# EAGLE design board (EAGLE 9.3.0)
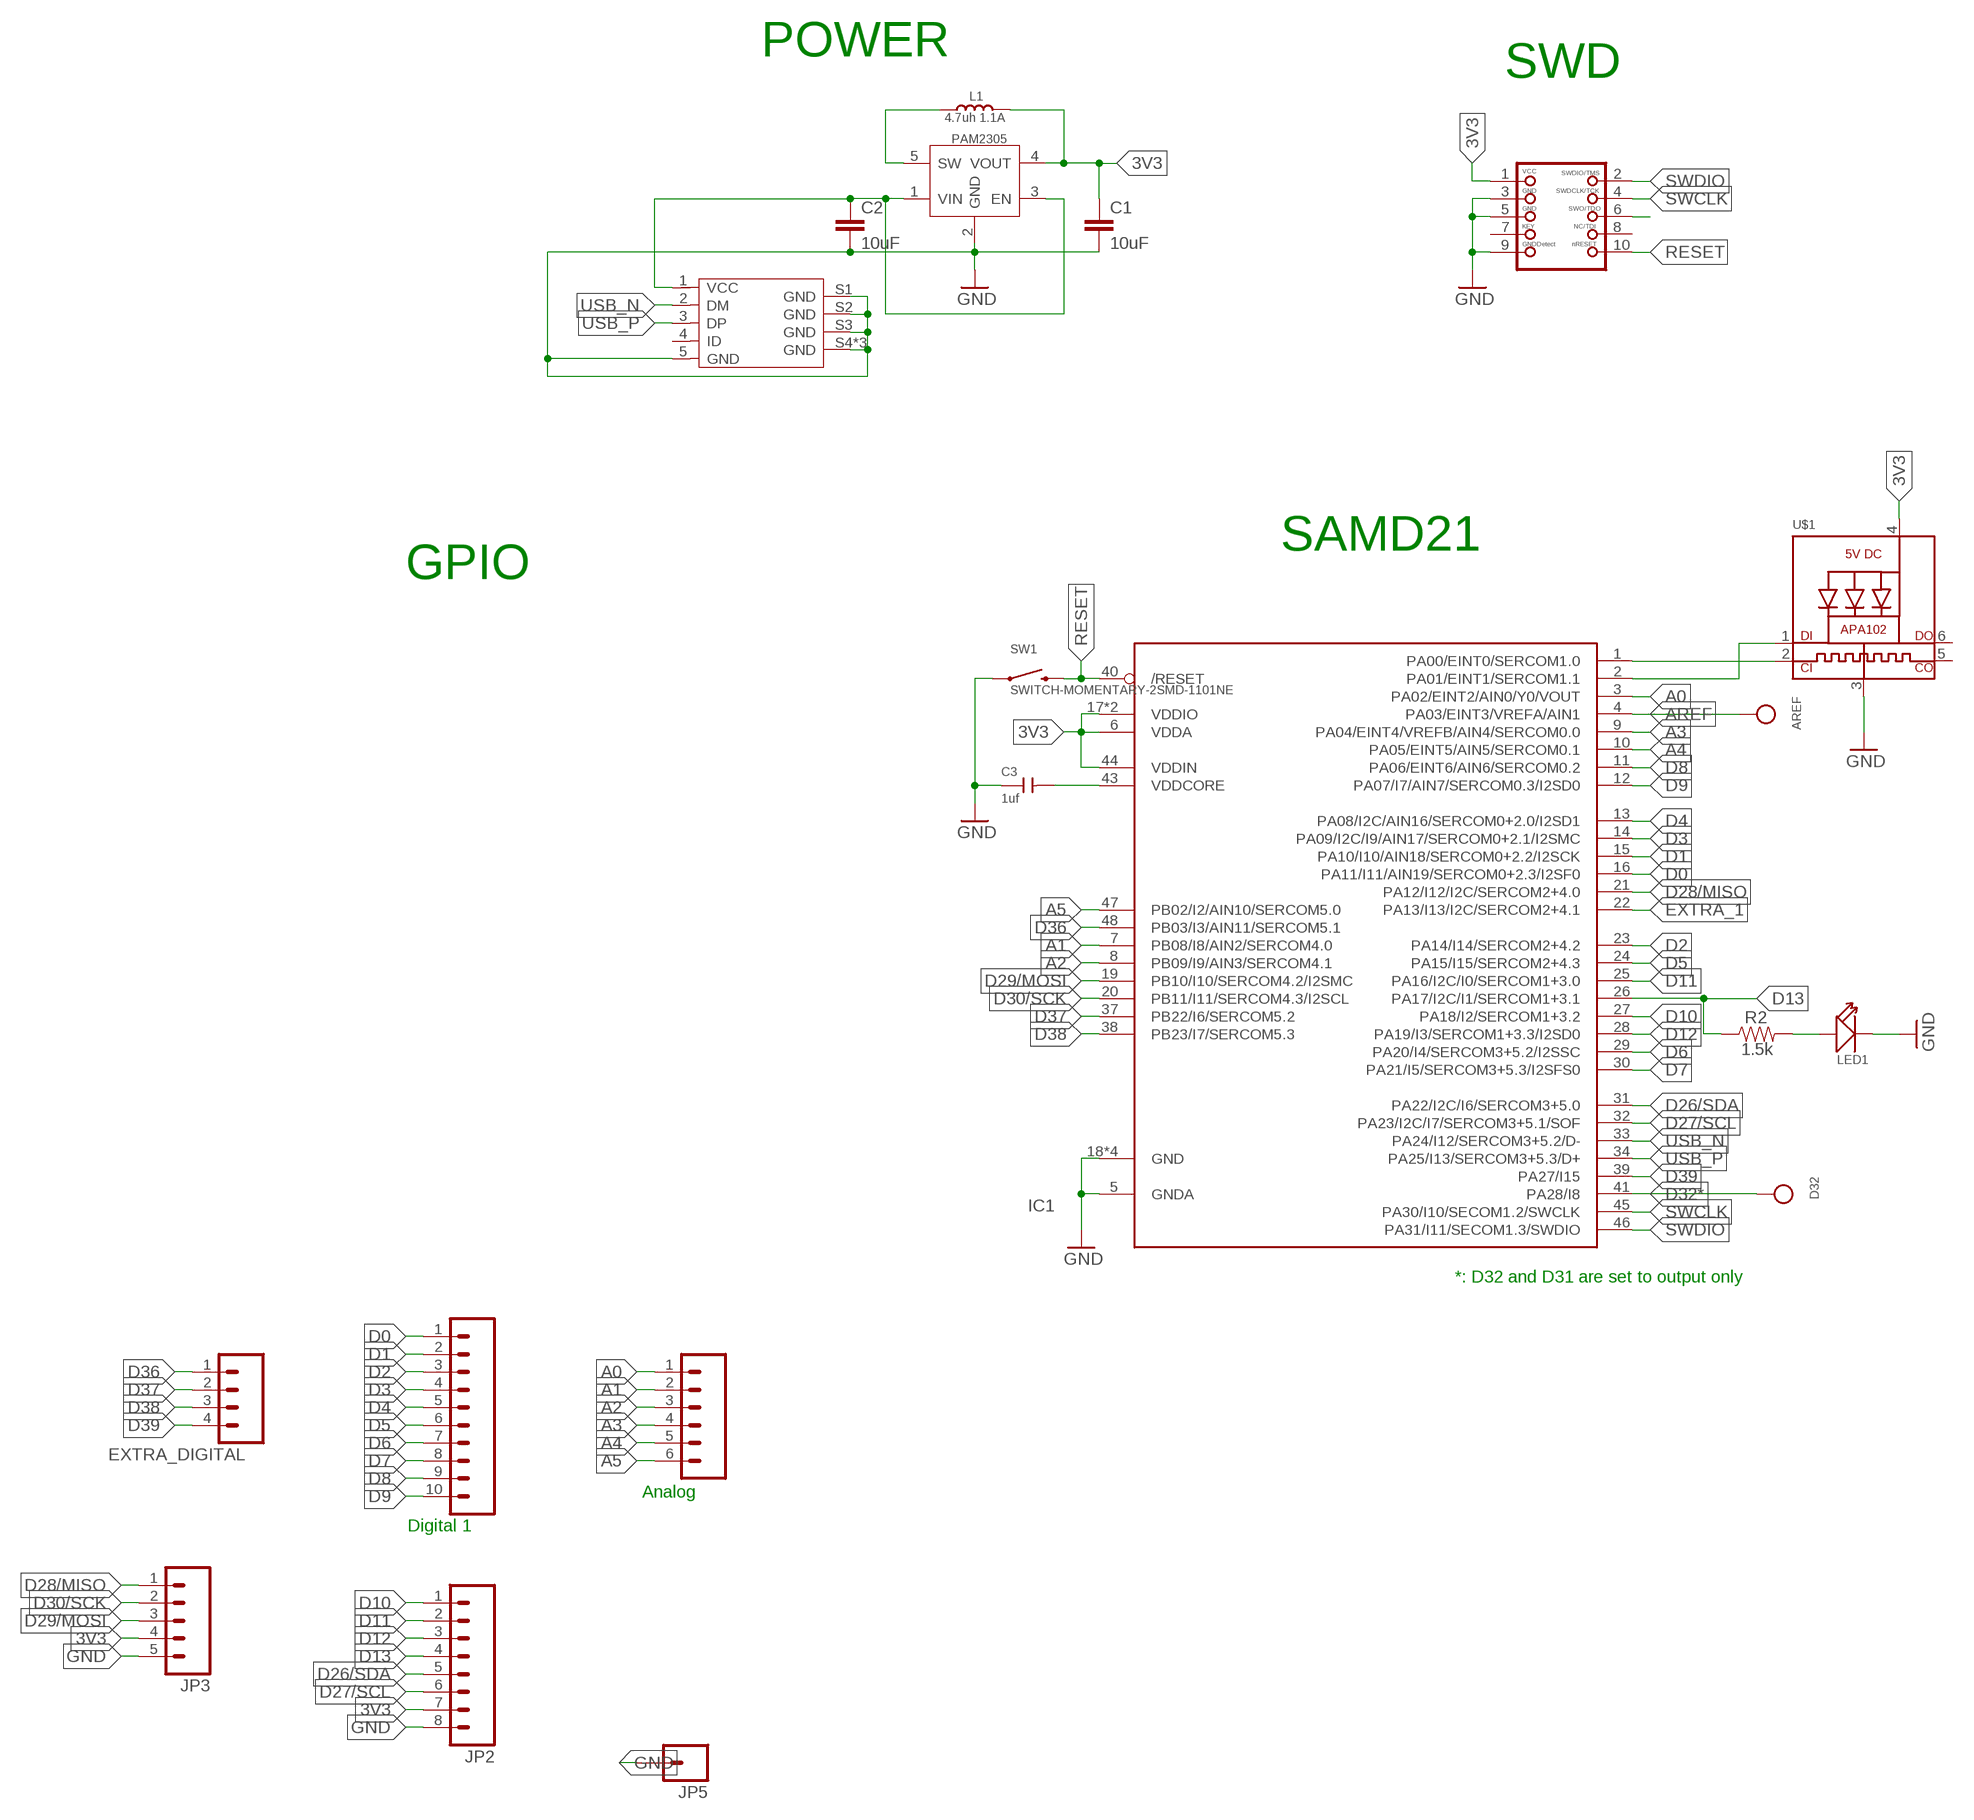
[diagram p0: schematic, sheet 1]

## Parts
ANALOG  6p-2.54  M06NO_SILK_FEMALE_PTH  [1X06_NO_SILK]
AREF  TESTPOINTROUND1MM  [TESTPOINT_ROUND_1MM]
C1  10uF  22UF-6.3V-20%(0805)  [0805]
C2  10uF  22UF-6.3V-20%(0805)  [0805]
C3  1uf  CERAMIC-1UF-25V-10%-X7R(0805)  [C0805]
D32  TESTPOINTROUND1MM  [TESTPOINT_ROUND_1MM]
EXTRA_DIGITAL  M04NO_SILK_ALL_ROUND  [1X04_NO_SILK_ALL_ROUND]
IC1  MICROBUILDER_ATSAMD21G_QFN  [MICROBUILDER_TQFN48_7MM]
JP1  M10NO_SILK_PTH_FEMALE  [1X10_NO_SILK]
JP2  M08NO_SILK_FEMALE_PTH  [1X08_NO_SILK]
JP3  M05NO_SILK  [1X05_NO_SILK]
JP5  M01PTH_NO_SILK_YES_STOP  [1X01_NO_SILK]
JTAG1  JTAG-CORTEXM3  [2X05_1.27MM_SMT]
L1  4.7uh 1.1A  SMD-INDUCTOR-4.7UH-20%-1.1A(1008)  [L1008]
LED1  RED-0805  SMD-LED-CLEAR-RED(0805)  [LED-0805]
PAM2305  XC6204B332MR-SOT23-5  PAM2305  [SOT-23-5]
R2  1.5k  RESISTOR0805-RES  [0805]
SW1  SWITCH-MOMENTARY-2SMD-1101NE  [TACTILE-SWITCH-1101NE]
U$1  MICROBUILDER_APA102  [MICROBUILDER_APA102]
USB2  ST-USB-001G  MICRO-USB-SMD-B-WITHOUT-POST-W/P(ST-USB-001G)  [MICRO-USB5+4P-SMD-0.65-B]

## Nets
3V3: C1.1 IC1.6(VDDA) IC1.17(VDDIO) IC1.36(VDDIO) IC1.44(VDDIN) JP2.7 JP3.4 JTAG1.1 L1.2 PAM2305.4(VOUT) U$1.4(VDD)
A0: ANALOG.1 IC1.3(PA02/EINT2/AIN0/Y0/VOUT)
A1: ANALOG.2 IC1.7(PB08/I8/AIN2/SERCOM4.0)
A2: ANALOG.3 IC1.8(PB09/I9/AIN3/SERCOM4.1)
A3: ANALOG.4 IC1.9(PA04/EINT4/VREFB/AIN4/SERCOM0.0)
A4: ANALOG.5 IC1.10(PA05/EINT5/AIN5/SERCOM0.1)
A5: ANALOG.6 IC1.47(PB02/I2/AIN10/SERCOM5.0)
AREF: AREF.P$1 IC1.4(PA03/EINT3/VREFA/AIN1)
D0: IC1.16(PA11/I11/AIN19/SERCOM0+2.3/I2SF0) JP1.1
D1: IC1.15(PA10/I10/AIN18/SERCOM0+2.2/I2SCK) JP1.2
D2: IC1.23(PA14/I14/SERCOM2+4.2) JP1.3
D3: IC1.14(PA09/I2C/I9/AIN17/SERCOM0+2.1/I2SMC) JP1.4
D4: IC1.13(PA08/I2C/AIN16/SERCOM0+2.0/I2SD1) JP1.5
D5: IC1.24(PA15/I15/SERCOM2+4.3) JP1.6
D6: IC1.29(PA20/I4/SERCOM3+5.2/I2SSC) JP1.7
D7: IC1.30(PA21/I5/SERCOM3+5.3/I2SFS0) JP1.8
D8: IC1.11(PA06/EINT6/AIN6/SERCOM0.2) JP1.9
D9: IC1.12(PA07/I7/AIN7/SERCOM0.3/I2SD0) JP1.10
D10: IC1.27(PA18/I2/SERCOM1+3.2) JP2.1
D11: IC1.25(PA16/I2C/I0/SERCOM1+3.0) JP2.2
D12: IC1.28(PA19/I3/SERCOM1+3.3/I2SD0) JP2.3
D13: IC1.26(PA17/I2C/I1/SERCOM1+3.1) JP2.4 R2.1
D26/SDA: IC1.31(PA22/I2C/I6/SERCOM3+5.0) JP2.5
D27/SCL: IC1.32(PA23/I2C/I7/SERCOM3+5.1/SOF) JP2.6
D28/MISO: IC1.21(PA12/I12/I2C/SERCOM2+4.0) JP3.1
D29/MOSI: IC1.19(PB10/I10/SERCOM4.2/I2SMC) JP3.3
D30/SCK: IC1.20(PB11/I11/SERCOM4.3/I2SCL) JP3.2
D32*: D32.P$1 IC1.41(PA28/I8)
D36: EXTRA_DIGITAL.1 IC1.48(PB03/I3/AIN11/SERCOM5.1)
D37: EXTRA_DIGITAL.2 IC1.37(PB22/I6/SERCOM5.2)
D38: EXTRA_DIGITAL.3 IC1.38(PB23/I7/SERCOM5.3)
D39: EXTRA_DIGITAL.4 IC1.39(PA27/I15)
D40: IC1.1(PA00/EINT0/SERCOM1.0) U$1.2(CKI)
D41: IC1.2(PA01/EINT1/SERCOM1.1) U$1.1(DI)
EXTRA_1: IC1.22(PA13/I13/I2C/SERCOM2+4.1)
GND: C1.2 C2.2 C3.1 IC1.5(GNDA) IC1.18(GND) IC1.35(GND) IC1.42(GND) IC1.GND JP2.8 JP3.5 JP5.1 JTAG1.3 JTAG1.5 JTAG1.9 LED1.- PAM2305.2(GND) SW1.1 U$1.3(GND) USB2.5(GND) USB2.S1(GND) USB2.S2(GND) USB2.S3(GND) USB2.S4(GND) USB2.S5(GND) USB2.S6(GND)
LED: LED1.+ R2.2
N$1: L1.1 PAM2305.5(SW)
N$5: JTAG1.6
N$6: C3.2 IC1.43(VDDCORE)
RESET: IC1.40(/RESET) JTAG1.10 SW1.2
SWCLK: IC1.45(PA30/I10/SECOM1.2/SWCLK) JTAG1.4
SWDIO: IC1.46(PA31/I11/SECOM1.3/SWDIO) JTAG1.2
USB_N: IC1.33(PA24/I12/SERCOM3+5.2/D-) USB2.2(DM)
USB_P: IC1.34(PA25/I13/SERCOM3+5.3/D+) USB2.3(DP)
VBAT: C2.1 PAM2305.1(VIN) PAM2305.3(EN) USB2.1(VCC)
Unconnected: JTAG1.7 JTAG1.8 U$1.5(CKO) U$1.6(DO) USB2.4(ID)

## Notes on the sheet
- POWER
- SWD
- SAMD21
- GPIO
- *: D32 and D31 are set to output only
- Analog
- Digital 1

## Library data of the parts
ANALOG = SparkFun-Connectors:M06: Header 6 Standard 6-pin 0.1" header. Use with straight break away headers (SKU : PRT-00116), right angle break away headers (PRT-00553), swiss pins (PRT-00743), machine pins (PRT-00117), and female headers (PRT-00115). Molex polarized connector foot print use with SKU : PRT-08094 with associated crimp pins and housings. NOTES ON THE VARIANTS LOCK and LOCK_LONGPADS... This footprint was designed to help hold the alignment of a through-hole component (i.e. 6-pin header) while soldering it into place. You may notice that each hole has been shifted either up or down by 0.005 of an inch from it's more standard position (which is a perfectly straight line). This slight alteration caused the pins (the squares in the middle) to touch the edges of the holes. Because they are alternating, it causes a "brace" to hold the component in place. 0.005 has proven to be the perfect amount of "off-center" position when using our standard breakaway headers. Although looks a little odd when you look at the bare footprint, once you have a header in there, the alteration is very hard to notice. Also,if you push a header all the way into place, it is covered up entirely on the bottom side. This idea of altering the position of holes to aid alignment will be further integrated into the Sparkfun Library for other footprints. It can help hold any component with 3 or more connection pins.; PROD_ID: CONN-08437
AREF D32 = microbuilder:TESTPOINT: Test Point Various test points for characterisation and PCB testing TESTPOINT_SMT - Compact Surface Mount Test Point [Digikey: 5016KTR-ND]
C1 C2 = SparkFun-Capacitors:22UF-6.3V-20%(0805): CAP-08402 Ceramic; PROD_ID: CAP-08402; VALUE: 22uF
C3 = Seeed-Capacitor:CERAMIC-1UF-25V-10%-X7R(0805): 302010179; MPN: CC0805KKX7R8BB105
EXTRA_DIGITAL = SparkFun-Connectors:M04: Header 4 Standard 4-pin 0.1" header. Use with straight break away headers (SKU : PRT-00116), right angle break away headers (PRT-00553), swiss pins (PRT-00743), machine pins (PRT-00117), and female headers (PRT-00115). Molex polarized connector foot print use with SKU : PRT-08231 with associated crimp pins and housings. 1MM SMD Version SKU: PRT-10208
IC1 = roblib:MICROBUILDER_ATSAMD21G
JP1 = SparkFun-Connectors:M10: Header 10 Standard 10-pin 0.1" header. Use with straight break away headers (SKU : PRT-00116), right angle break away headers (PRT-00553), swiss pins (PRT-00743), machine pins (PRT-00117), and female headers (PRT-00115).; PROD_ID: CONN-11563
JP2 = SparkFun-Connectors:M08: Header 8 Standard 8-pin 0.1" header. Use with straight break away headers (SKU : PRT-00116), right angle break away headers (PRT-00553), swiss pins (PRT-00743), machine pins (PRT-00117), and female headers (PRT-00115).; PROD_ID: CONN-08438
JP3 = SparkFun-Connectors:M05: Header 5 Standard 5-pin 0.1" header. Use with straight break away headers (SKU : PRT-00116), right angle break away headers (PRT-00553), swiss pins (PRT-00743), machine pins (PRT-00117), and female headers (PRT-00115). Molex polarized connector foot print use with SKU : PRT-08230 with associated crimp pins and housings.
JP5 = SparkFun-Connectors:M01: Header 1 Standard 1-pin 0.1" header. Use with straight break away headers (SKU : PRT-00116), right angle break away headers (PRT-00553), swiss pins (PRT-00743), machine pins (PRT-00117), and female headers (PRT-00115).
JTAG1 = microbuilder:JTAG-CORTEXM3: Serial Wire (SW-DP) Connector This standard 0.05" 10-pin connector is for use with the Cortex M0/M3's native SWD (serial wire debugger) interface (SW-DP). Some boards support a 20-pin combined JTAG+SWD connector (SWJ-DP), such as the LPC1700 family, but many smaller devices only work with SWD which typically use the smaller 10-pin SW-DP connecter (the LPC1300 family, for example, only supports SWD). 2x05 1.27mm/0.05" Connector: This is the standard SMT connector defined by ARM for all Cortex devices, and should be used in most situations and for forward-compatibility since any new devices coming to market will likely use this connector. MOLEX 10 Pin 0.1" Connector: This 0.1" 10 pin connector has the same pin layout as the standard 0.05" connector, but is easier to work with if you are using standard jumper wires or custom cables to connect your SWD hardware. MOLEX 20 Pin 0.1" Connector: This 0.1" 20 pin connector is the same model used for ARM7/ARM9 JTAG debuggers, but is connected to match the pins on the Segger J-Link for ARM (which supports both JTAG and SWD debugging). See the following document from ARM for more information on Cortex M3 Debug Connectors: http://infocenter.arm.com/help/topic/com.arm.doc.faqs/attached/13634/cortex_debug_connectors.pdf And the following page for an overview with images of the different connector types: http://www.keil.com/peripherals/coresight/connectors.asp
L1 = Seeed-OPL-Inductor:SMD-INDUCTOR-4.7UH-20%-1.1A(1008): 303010149; MPN: CIG22L4R7MNE
LED1 = Seeed-LED:SMD-LED-CLEAR-RED(0805): 304090046; MPN: 17-215SURC/S530-A2/TR8
PAM2305 = roblib:PAM2305: 310030046; MPN: XC6204B332MR
R2 = SparkFun-Resistors:RESISTOR: Resistor Basic schematic elements and footprints for 0603, 1206, and PTH resistors.
SW1 = SparkFun-Electromechanical:SWITCH-MOMENTARY-2: Various NO switches- pushbuttons, reed, etc; PROD_ID: SWCH-00815
U$1 = Trinket M0 rev D:MICROBUILDER_APA102: APA102/DotStar Pixels VCC: 5V DC Refresh Rate: 400Hz
USB2 = Seeed-OPL-Connector:MICRO-USB-SMD-B-WITHOUT-POST-W/P(ST-USB-001G): 320010000; MPN: ST-USB-001G

## Board
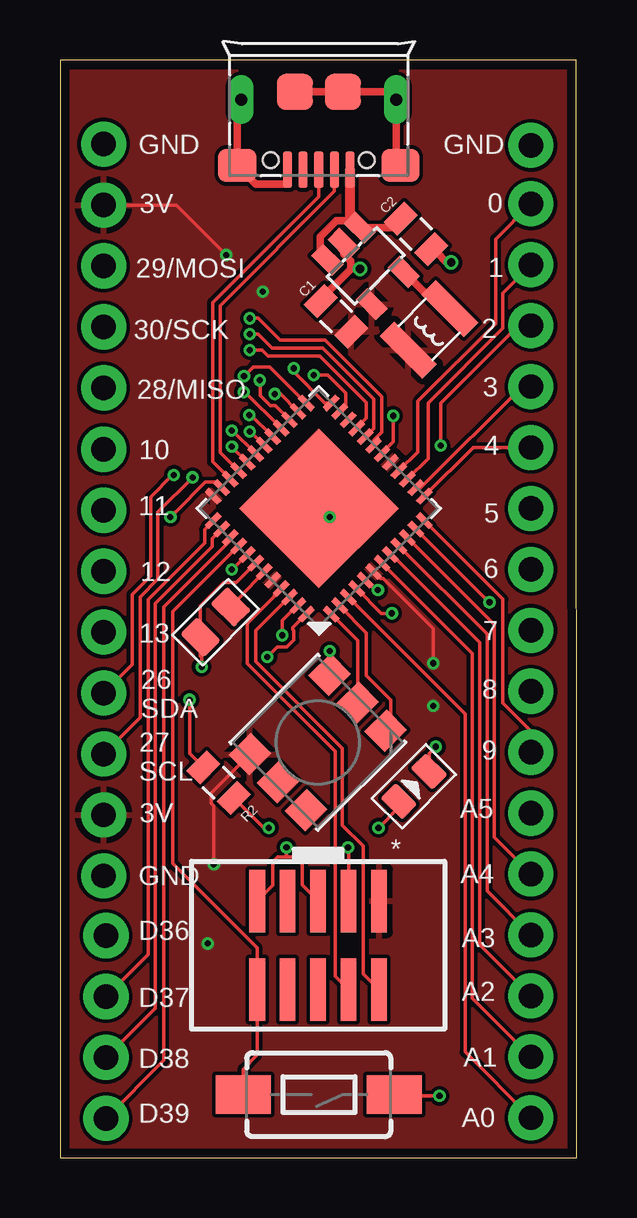
[diagram p1: board, top side]
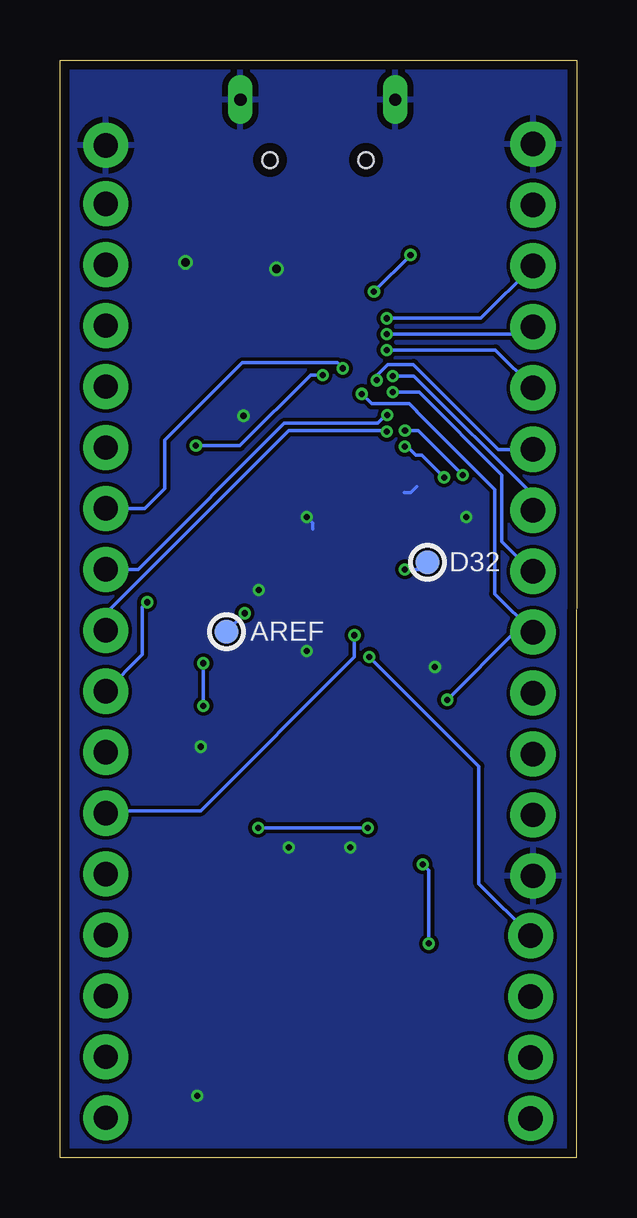
[diagram p2: board, bottom side, seen from below]

Size 21.53 x 45.77 mm. Coordinates in mm from the lower left corner, seen from the top.
Outline: 0.01,0 21.53,0 21.51,45.77 0,45.77 0.01,0
Copper layers (1*16): Top 0.035559375mm / dielectric 1.6mm / Bottom 0.035559375mm
Design rules "oshpark-2layer (1) *": minimum track width 6mil, minimum drill 10mil, track to track 6mil, track to pad 6mil, pad to pad 6mil, via to via 6mil, smd to smd 6mil, copper to edge 15mil, drill to drill 6mil, minimum pad ring 5mil, minimum via ring 5mil, stop-mask expansion 2.5mil, vias tented up to drill 15mil, thermal gap 10mil

### Footprints (pad centres in the part's own frame; a part is rotated, then mirrored left to right if it is on the bottom)
1X06_NO_SILK = drill 1.016 pad 1.88: 1 0,0; 2 2.54,0; 3 5.08,0; 4 7.62,0; 5 10.16,0; 6 12.7,0
TESTPOINT_ROUND_1MM = smd 1 x 1: P$1 0,0
0805 = smd 0.8 x 1.2: 1 -0.9,0; 2 0.9,0
C0805 = smd 1.397 x 1.016: 1 0,0.889; 2 0,-0.889
1X04_NO_SILK_ALL_ROUND = drill 1.016 pad 1.88: 1 0,0; 2 2.54,0; 3 5.08,0; 4 7.62,0
MICROBUILDER_TQFN48_7MM = smd 0.25 x 0.75: 1 -2.75,-3.475; 2 -2.25,-3.475; 3 -1.75,-3.475; 4 -1.25,-3.475; 5 -0.75,-3.475; 6 -0.25,-3.475; 7 0.25,-3.475; 8 0.75,-3.475; 9 1.25,-3.475; 10 1.75,-3.475; 11 2.25,-3.475; 12 2.75,-3.475; 25 2.75,3.475; 26 2.25,3.475; 27 1.75,3.475; 28 1.25,3.475; 29 0.75,3.475; 30 0.25,3.475; 31 -0.25,3.475; 32 -0.75,3.475; 33 -1.25,3.475; 34 -1.75,3.475; 35 -2.25,3.475; 36 -2.75,3.475 | smd 0.75 x 0.25: 13 3.475,-2.75; 14 3.475,-2.25; 15 3.475,-1.75; 16 3.475,-1.25; 17 3.475,-0.75; 18 3.475,-0.25; 19 3.475,0.25; 20 3.475,0.75; 21 3.475,1.25; 22 3.475,1.75; 23 3.475,2.25; 24 3.475,2.75; 37 -3.475,2.75; 38 -3.475,2.25; 39 -3.475,1.75; 40 -3.475,1.25; 41 -3.475,0.75; 42 -3.475,0.25; 43 -3.475,-0.25; 44 -3.475,-0.75; 45 -3.475,-1.25; 46 -3.475,-1.75; 47 -3.475,-2.25; 48 -3.475,-2.75 | smd 4.7 x 4.7: GND 0,0
1X10_NO_SILK = drill 1.016 pad 1.88: 1 0,0; 2 2.54,0; 3 5.08,0; 4 7.62,0; 5 10.16,0; 6 12.7,0; 7 15.24,0; 8 17.78,0; 9 20.32,0; 10 22.86,0
1X08_NO_SILK = drill 1.016 pad 1.88: 1 0,0; 2 2.54,0; 3 5.08,0; 4 7.62,0; 5 10.16,0; 6 12.7,0; 7 15.24,0; 8 17.78,0
1X05_NO_SILK = drill 1.016 pad 1.88: 1 0,0; 2 2.54,0; 3 5.08,0; 4 7.62,0; 5 10.16,0
1X01_NO_SILK = drill 1.016 pad 1.88: 1 0,0
2X05_1.27MM_SMT = smd 0.65 x 2.6: 1 -2.54,-1.85; 2 -2.54,1.85; 3 -1.27,-1.85; 4 -1.27,1.85; 5 0,-1.85; 6 0,1.85; 7 1.27,-1.85; 8 1.27,1.85; 9 2.54,-1.85; 10 2.54,1.85
L1008 = smd 0.85 x 2.5: 1 -1.225,0; 2 1.225,0
LED-0805 = smd 0.889 x 1.27: + -0.889,0; - 0.889,0
SOT-23-5 = smd 0.69 x 1.2: 1 -0.95,-1.3; 2 0,-1.3; 3 0.95,-1.3; 4 0.95,1.3; 5 -0.95,1.3
TACTILE-SWITCH-1101NE = smd 2.3 x 1.6: 1 -3.15,0; 2 3.15,0
MICROBUILDER_APA102 = smd 1.3 x 1.2: 1 -2.35,1.65; 2 -2.35,0; 3 -2.35,-1.65; 4 2.35,-1.65; 5 2.35,0; 6 2.35,1.65
MICRO-USB5+4P-SMD-0.65-B = smd 0.381 x 1.524: 1 -1.3,-0.25; 2 -0.65,-0.25; 3 0,-0.25; 4 0.65,-0.25; 5 1.3,-0.25 | smd 1.6 x 1.397: S1 -3.4,-0.427; S6 3.4,-0.427 | drill 0.508 pad 1.016 long: S2 -3.226,-3.175; S5 3.226,-3.175 | smd 1.5 x 1.5: S3 -1,-3.5; S4 1,-3.5 | hole 0.635: -2,-0.65; 2,-0.65

### Placement (x,y rotation side)
ANALOG  19.62,1.68 90 top
AREF  14.59,21.95 90 bottom
C1  11.5,35.09 135 top
C2  14.83,38.52 315 top
C3  6.48,22.34 135 top
D32  6.21,24.84 0 bottom
EXTRA_DIGITAL  1.92,9.27 270 top
IC1  10.78,27.08 45 top
JP1  19.62,39.78 270 top
JP2  1.82,29.54 270 top
JP3  1.82,32.11 90 top
JP5  19.62,42.21 0 top
JTAG1  10.76,8.86 180 top
L1  15.38,34.54 225 top
LED1  14.75,15.49 45 top
PAM2305  12.74,37.19 225 top
R2  6.61,15.65 315 top
SW1  10.78,2.64 180 top
U$1  10.74,17.32 225 top
USB2  10.78,40.94 180 top

### Tracks (layer width: path | path; a pad name or v marks a point on that pad's centre or on a via)
3V3  (via drill 0.25)
  Top 0.152: JP3.4 4.84,39.73 v6.92,37.64 | v6.41,12.24 6.41,14.67 6.31,14.78 6.31,15.23 U$1.4 | IC1.6 13.35,24.16 13.47,24.16 15.56,22.07 v15.56,20.62
  Bottom 0.152: v6.92,37.64 v8.45,36.12 | v6.41,12.24 6.16,11.99 v6.16,8.94 | v15.56,20.62 v15.56,18.85
  pour Top: -19.39,97.08 44.62,97.08 44.62,-30.38 -19.39,-30.38
A0
  Top 0.152: IC1.3 16.88,18.51 16.88,4.42 ANALOG.1
A1
  Top 0.152: ANALOG.2 17.18,6.65 17.18,21.03 IC1.7
A2
  Top 0.152: ANALOG.3 17.49,8.89 17.49,21.49 13.83,25.15 IC1.8
A3
  Top 0.152: IC1.9 17.79,21.83 17.79,11.12 ANALOG.4
A4
  Top 0.152: IC1.10 18.1,22.24 18.1,13.36 ANALOG.5
A5  (via drill 0.25)
  Top 0.152: v9.26,21.79 9.26,22.4 9.88,23.03 IC1.47
  Bottom 0.152: ANALOG.6 19.52,14.48 15.66,14.48 9.26,20.88 v9.26,21.79
AREF  (via drill 0.25)
  Top 0.152: IC1.4 13.38,22.71 v13.83,22.71
  Bottom 0.152: AREF.P$1 v13.83,22.71
D0
  Top 0.152: IC1.16 14.91,29.44 14.91,31.55 18.15,34.78 18.15,38.3 JP1.1
D1
  Top 0.152: IC1.15 15.34,29.16 15.34,31.47 18.45,34.58 18.45,36.04 19.62,37.21 JP1.2
D2  (via drill 0.25)
  Top 0.152: JP1.3 19.09,34.7 15.86,31.47 v15.86,29.69 | IC1.23 11.9,31.38 11.9,31.89 11.15,32.64 v10.58,32.64
  Bottom 0.152: v10.58,32.64 11.09,32.64 14.03,29.69 v15.86,29.69
D3
  Top 0.152: JP1.4 19.25,32.16 15.04,27.94 IC1.14
D4
  Top 0.152: IC1.13 17.21,29.62 JP1.5
D5  (via drill 0.25)
  Top 0.152: v9.74,32.92 9.74,32.78 11.04,31.48 IC1.24
  Bottom 0.152: JP1.6 18,27.08 17.16,27.91 17.16,29.92 13.93,33.15 9.97,33.15 v9.74,32.92
D6  (via drill 0.25)
  Top 0.152: IC1.29 7.96,30.96 v7.89,30.96
  Bottom 0.152: v7.89,30.96 7.96,30.96 8.29,30.63 12.18,30.63 18.28,24.54 JP1.7
D7  (via drill 0.25)
  Top 0.152: v7.91,30.28 7.94,30.28 IC1.30
  Bottom 0.152: v7.91,30.28 7.96,30.33 12,30.33 19.62,22.71 JP1.8
D8  (via drill 0.25)
  Top 0.152: IC1.11 17.88,23.16 v17.89,23.16
  Bottom 0.152: v17.89,23.16 18.1,22.96 18.1,20.98 JP1.9
D9
  Top 0.152: JP1.10 19.62,17.8 18.45,18.97 18.45,23.29 IC1.12
D10  (via drill 0.25)
  Top 0.152: v8.33,32.42 8.34,32.4 8.34,31.78 8.75,31.37 8.96,31.37 IC1.27
  Bottom 0.152: v8.33,32.42 8.33,32.62 7.87,33.08 6.8,33.08 3.26,29.54 JP2.1
D11  (via drill 0.25)
  Top 0.152: v7.67,32.6 8.05,32.98 8.74,32.98 10.24,31.48 IC1.25
  Bottom 0.152: v7.67,32.6 6.78,32.6 1.82,27.63 JP2.2
D12  (via drill 0.25)
  Top 0.152: IC1.28 7.7,31.93 v7.66,31.93
  Bottom 0.152: v7.66,31.93 6.57,31.93 3.11,28.47 3.11,25.7 1.87,24.46 JP2.3
D13  (via drill 0.25)
  Top 0.152: v8.95,31.85 9.19,31.85 IC1.26 | R2.1 5.4,16.86 v5.4,19.1
  Bottom 0.152: v8.95,31.85 8.55,31.44 6.98,31.44 6.67,31.14 6.67,31.11 3.42,27.86 3.42,23.52 JP2.4 2.58,21.92 v5.4,19.1
D26/SDA  (via drill 0.25)
  Top 0.152: JP2.5 3.01,20.57 3.01,23.49 3.77,24.25 3.77,27.56 4.69,28.47 v4.74,28.47 | v7.15,30.33 7.18,30.33 IC1.31
  Bottom 0.152: v4.74,28.47 6.59,30.33 v7.15,30.33
D27/SCL  (via drill 0.25)
  Top 0.152: v5.52,28.37 4.08,26.92 4.08,24.13 3.34,23.39 3.34,18.36 JP2.6 | v7.16,29.65 7.16,29.64 IC1.32
  Bottom 0.152: v5.52,28.37 6.45,29.3 6.71,29.3 7.06,29.65 v7.16,29.65
D28/MISO  (via drill 0.25)
  Top 0.152: IC1.21 12.36,30.43 12.76,30.84 12.76,31.5 10.83,33.43 8.67,33.43 8.42,33.68 v7.91,33.68
  Bottom 0.152: JP3.1 3.39,33.68 v7.91,33.68
D29/MOSI  (via drill 0.25)
  Top 0.152: IC1.19 13.06,29.92 13.4,30.25 13.4,31.74 11.06,34.09 9.18,34.09 8.27,35 v7.91,35
  Bottom 0.152: JP3.3 4,35 v7.91,35
D30/SCK  (via drill 0.25)
  Top 0.152: IC1.20 12.73,30.06 13.07,30.4 13.07,31.64 10.96,33.76 8.85,33.76 8.27,34.34 v7.91,34.34
  Bottom 0.152: JP3.2 2.12,34.34 v7.91,34.34
D32*  (via drill 0.25)
  Top 0.152: IC1.41 7.18,24.54 v7.16,24.54
  Bottom 0.152: v7.16,24.54 6.52,24.54 D32.P$1
D36  (via drill 0.25)
  Top 0.152: IC1.48 9.7,22.11 9.7,22.03 9.74,21.99 9.74,21.59 9.46,21.31 9.06,21.31 v8.64,20.89
  Bottom 0.152: v8.64,20.89 4.08,16.33 4.08,11.43 EXTRA_DIGITAL.1
D37
  Top 0.152: IC1.37 6.02,26.21 6.02,25.65 3.67,23.29 3.67,8.48 EXTRA_DIGITAL.2
D38
  Top 0.152: EXTRA_DIGITAL.3 3.98,6.25 3.98,23.12 6.35,25.49 6.35,25.83 IC1.38
D39
  Top 0.152: EXTRA_DIGITAL.4 4.33,4.06 4.33,22.97 7.09,25.73 IC1.39
D40
  Top 0.152: U$1.2 12.4,21.57 IC1.1
D41
  Top 0.152: U$1.1 13.78,18.03 13.78,19.1 12.76,20.12 12.76,21.89 11.65,23.01 IC1.2
GND  (via drill 0.25, 0.35)
  Top 0.152: 9.44,12.54 9.07,12.54 8.86,12.33 8.86,11.35 JTAG1.9 | JTAG1.5 10.09,11.38 10.09,12.36 9.91,12.54 9.44,12.54 | v12,12.95 12.03,12.93 JTAG1.3 | 9.44,12.54 v9.44,12.95 | SW1.1 13.98,2.59 v15.81,2.59 | IC1.GND 10.99,26.87 10.99,26.47 v11.24,26.72 | v5.91,20.47 5.91,20.88 5.85,20.93 C3.1 5.85,23.02 6.83,23.99 7.35,23.99 IC1.42 | U$1.3 v11.24,21.13 | IC1.5 13.13,23.67 v13.25,23.67 | v4.6,26.72 4.8,26.93 4.81,26.93 6.06,28.17 6.55,28.17 6.73,27.99 IC1.35 | LED1.- 15.38,16.86 v15.66,17.14 | IC1.18 13.42,29.41 13.88,29.87 v13.88,30.94 | 15.57,37.75 15.47,37.86 C2.2 | PAM2305.2
  Top 0.305: PAM2305.2 11.82,37.68 12.12,37.38 12.12,37.11 | 12.12,37.11 12.12,37.05 10.66,35.59 10.74,35.59 C1.2 | 12.12,37.11 12.45,37.11 v12.5,37.06 | 15.57,37.75 15.7,37.75 16.12,37.33 v16.3,37.33 | USB2.S4 USB2.S3 13.68,44.44 USB2.S2 14.01,41.55 USB2.S1 | USB2.S5 7.38,43.95 USB2.S6 8.16,40.59 9.49,40.59 9.51,40.61 9.48,40.64 USB2.5
  Bottom 0.152: v11.24,26.72 10.99,26.47 10.99,26.21 | v4.6,26.72 4.65,26.72 | 6.67,27.99 6.92,27.74 7.18,27.74
  pour Bottom: -44.69,61.72 -44.69,-6.4 46.6,-6.4 46.6,61.72
LED  (via drill 0.25)
  Top 0.152: R2.2 8.49,13.77 v8.7,13.77 | v13.27,13.77 14.12,14.61 LED1.+
  Bottom 0.152: v8.7,13.77 v13.27,13.77
N$1
  Top 0.152: L1.1 16.3,35.36 | 16.3,35.36 | PAM2305.5
  Top 0.305: PAM2305.5 16.1,35.16 16.3,35.36
N$6
  Top 0.152: C3.2 IC1.43
RESET
  Top 0.152: SW1.2 7.63,3.71 8.22,4.29 JTAG1.10 8.22,8.76 4.71,12.27 4.71,22.79 7.42,25.5 IC1.40
SWCLK
  Top 0.152: IC1.45 8.93,23.46 8.93,23.4 7.8,22.27 7.8,20.61 11.46,16.95 11.46,7.58 JTAG1.4
SWDIO
  Top 0.152: JTAG1.2 12.63,7.68 12.63,13.01 11.77,13.87 11.77,17.08 8.16,20.69 8.16,21.99 9.55,23.38 IC1.46
USB_N
  Top 0.152: IC1.33 7.43,28.65 6.67,29.41 6.67,35.53 11.43,40.3 USB2.2
USB_P
  Top 0.152: 6.36,29.02 IC1.34 6.36,29.02 | 6.36,29.02 6.36,35.66 | 6.36,35.66 10.78,40.08 | 6.36,29.02 6.36,35.66 | 6.36,35.66 10.78,40.08 | 10.78,40.08 USB2.3
VBAT
  Top 0.152: C2.1 14.24,39.2 14.35,39.2 | PAM2305.1 | PAM2305.1 12.51,38.78 | PAM2305.3
  Top 0.305: 14.35,39.2 13.92,38.78 12.51,38.78 PAM2305.1 12.2,39.08 11.51,39.08 10.85,38.41 10.85,37.73 PAM2305.3
  Top 0.406: USB2.1 12.08,39.2 12.51,38.78

### Text on the board
tNames: GND | GND | 3V | 0 | 29/MOSI | 1 | 30/SCK | 2 | 28/MISO | 3 | 10 | 4 | 11 | 5 | 12 | 6 | 7 | 13 | 8 | 26 / SDA | 9 | 27 / SCL | 3V | A5 | * | GND | A4 | D36 | A3 | D37 | A2 | D38 | A1 | D39 | A0